# EAGLE design Interface (EAGLE 7.5.0)
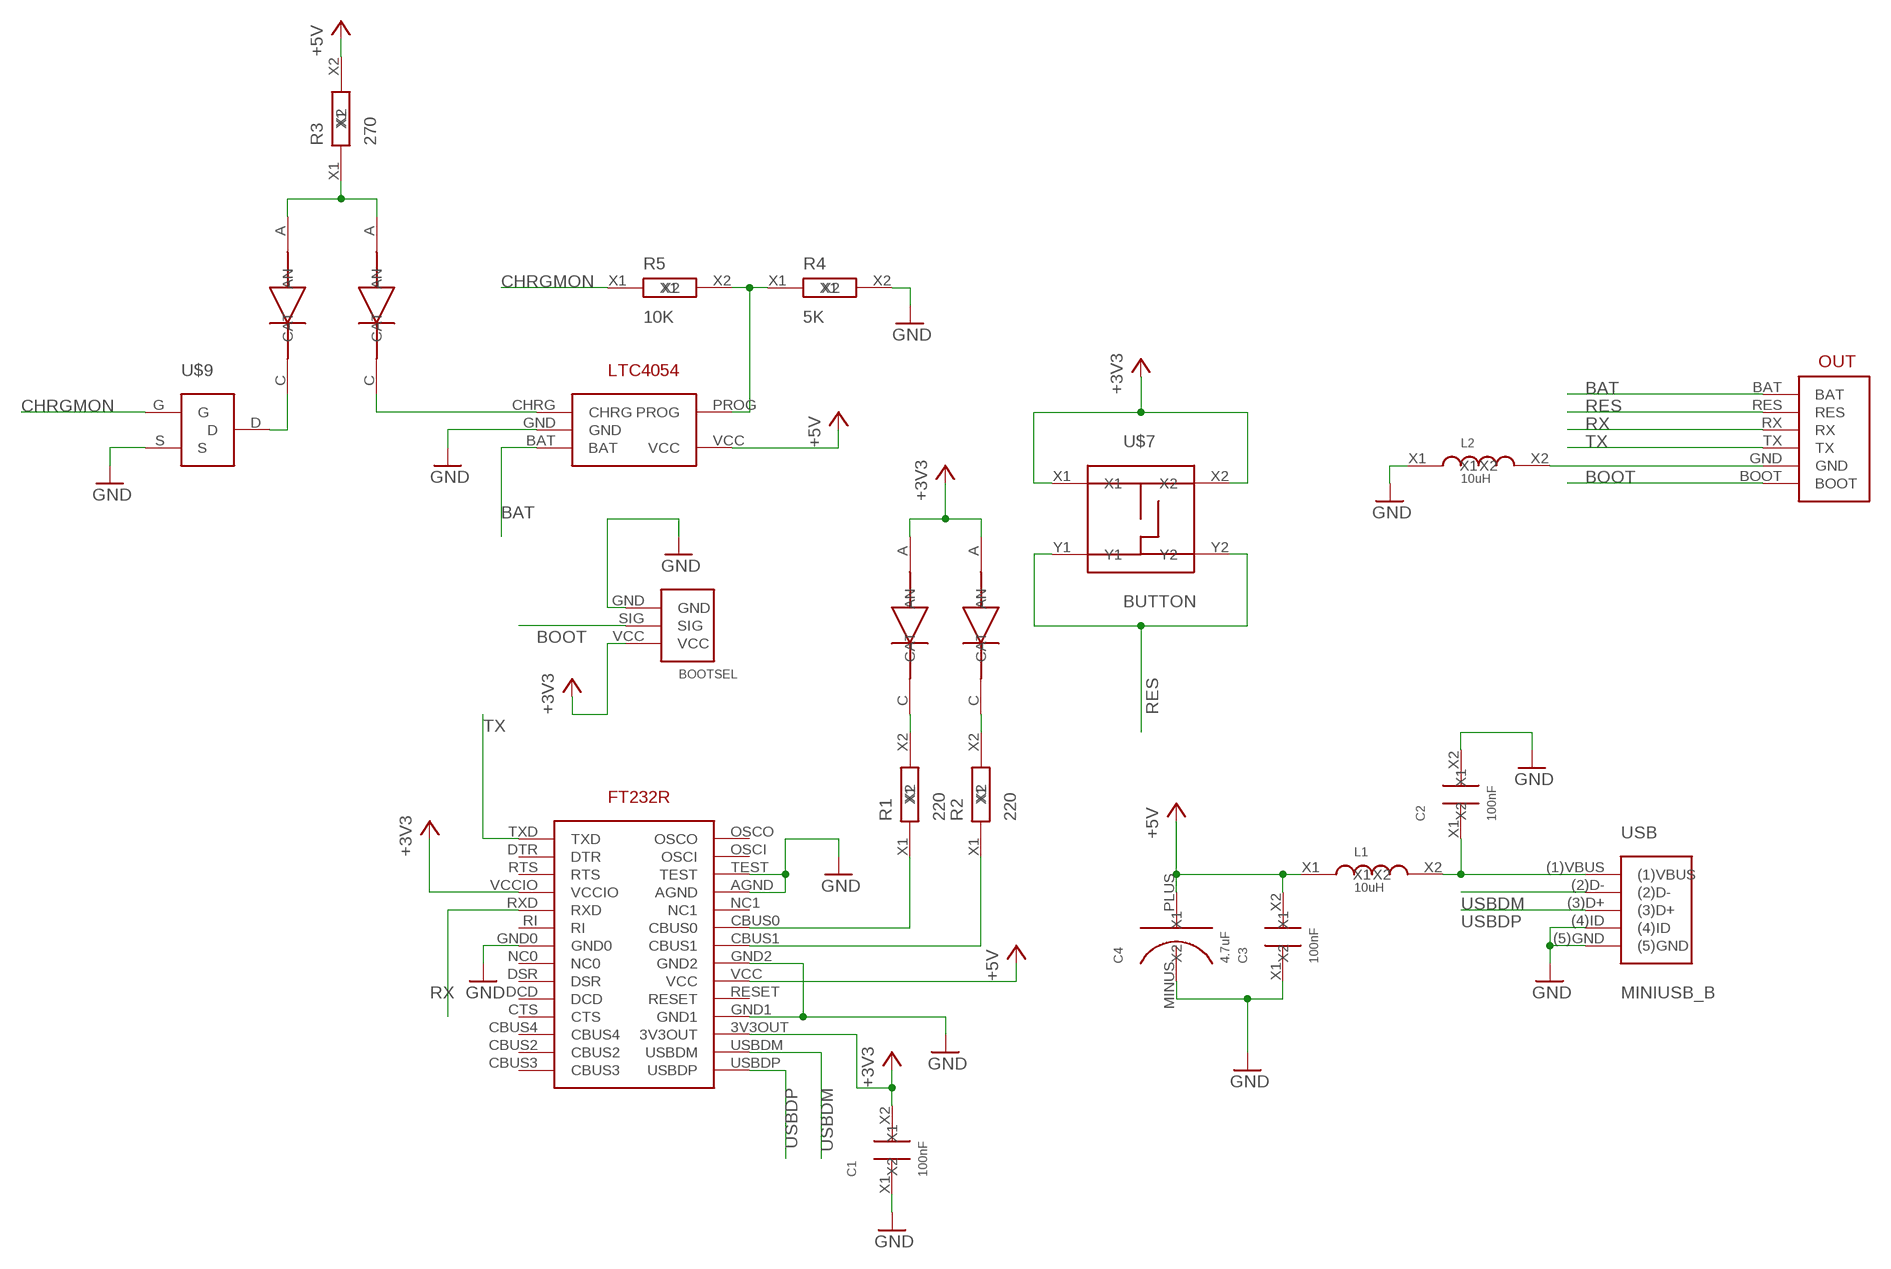
[diagram p0: schematic, sheet 1]

## Parts
BOOTSEL  BOOT3PIN  [BOOT3PIN]
C1  100nF  C_SMD_2.1X1.25  [SMD_2.1X1.25]
C2  100nF  C_SMD_2.1X1.25  [SMD_2.1X1.25]
C3  100nF  C_SMD_2.1X1.25  [SMD_2.1X1.25]
C4  4.7uF  C_SMD_TA_A  [C_SMD_TA_A]
L1  10uH  L_SMD_2.1X1.25  [SMD_2.1X1.25]
L2  10uH  L_SMD_2.1X1.25  [SMD_2.1X1.25]
R1  220  R_SMD_2.1X1.25  [SMD_2.1X1.25]
R2  220  R_SMD_2.1X1.25  [SMD_2.1X1.25]
R3  270  R_SMD_2.1X1.25  [SMD_2.1X1.25]
R4  5K  R_SMD_2.1X1.25  [SMD_2.1X1.25]
R5  10K  R_SMD_2.1X1.25  [SMD_2.1X1.25]
U$1  FT232R  [FT232]
U$2  LTC4054  [LTC4054]
U$3  LED0805  [LED0805]
U$4  LED0805  [LED0805]
U$5  LED0805  [LED0805]
U$6  LED0805  [LED0805]
U$7  BUTTON  [BUTTON]
U$8  PLUG6PIN  [PLUG6PIN]
U$9  IRFML8244TRPBF  [IRFML8244TRPBF]
USB  MINIUSB_B  [MINIUSB_B]

## Nets
+3V3: BOOTSEL.VCC C1.X2 U$1.3V3OUT U$1.VCCIO U$4.A(AN) U$6.A(AN) U$7.X1 U$7.X2
+5V: C3.X2 C4.PLUS(X2) L1.X1 R3.X2 U$1.VCC U$2.VCC
BAT: U$2.BAT U$8.BAT
BOOT: BOOTSEL.SIG U$8.BOOT
CHRGMON: R5.X1 U$9.G
GND: BOOTSEL.GND C1.X1 C2.X2 C3.X1 C4.MINUS(X1) L2.X1 R4.X2 U$1.AGND U$1.GND0 U$1.GND1 U$1.GND2 U$1.TEST U$2.GND U$9.S USB.(4)ID USB.(5)GND
N$1: C2.X1 L1.X2 USB.(1)VBUS
N$2: R3.X1 U$3.A(AN) U$5.A(AN)
N$3: R1.X2 U$4.C(CAT)
N$4: R2.X2 U$6.C(CAT)
N$5: R1.X1 U$1.CBUS0
N$6: R2.X1 U$1.CBUS1
N$7: U$2.CHRG U$3.C(CAT)
N$8: U$5.C(CAT) U$9.D
N$9: L2.X2 U$8.GND
N$10: R4.X1 R5.X2 U$2.PROG
RES: U$7.Y1 U$7.Y2 U$8.RES
RX: U$1.RXD U$8.RX
TX: U$1.TXD U$8.TX
USBDM: U$1.USBDM USB.(2)D-
USBDP: U$1.USBDP USB.(3)D+
Unconnected: U$1.CBUS2 U$1.CBUS3 U$1.CBUS4 U$1.CTS U$1.DCD U$1.DSR U$1.DTR U$1.NC0 U$1.NC1 U$1.OSCI U$1.OSCO U$1.RESET U$1.RI U$1.RTS

## Library data of the parts
BOOTSEL = MyCMOSsensor:BOOT3PIN
C1-C3 = MyPowerComponents:C_SMD_2.1X1.25
C4 = MyAmSys:C_SMD_TA_A
L1 L2 = MyPowerComponents:L_SMD_2.1X1.25
R1-R5 = MyPowerComponents:R_SMD_2.1X1.25
U$1 = My_FTDI:FT232R
U$2 = My_FTDI:LTC4054
U$3-U$6 = My_FTDI:LED0805
U$7 = My_STM32:BUTTON
U$8 = My_FTDI:PLUG6PIN
U$9 = My_STM32:IRFML8244TRPBF
USB = MyCMOSsensor:MINIUSB_B

## Board
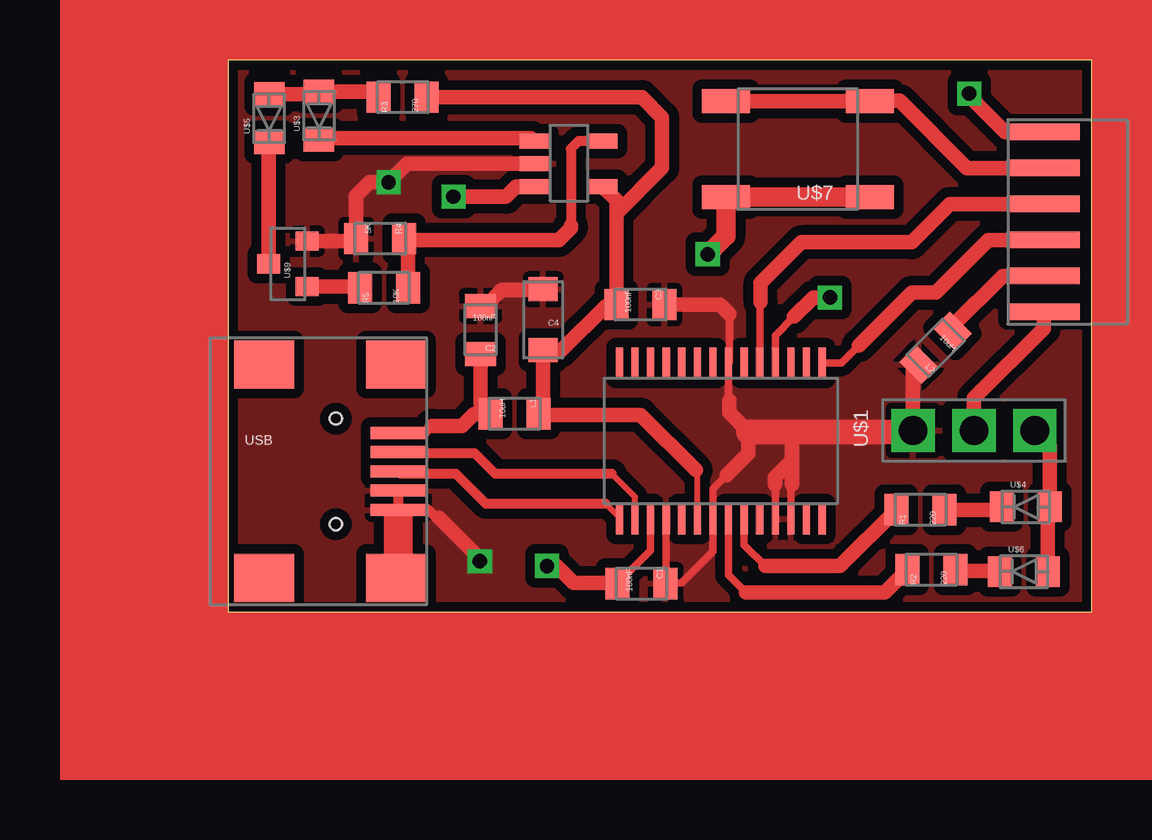
[diagram p1: board, top side]
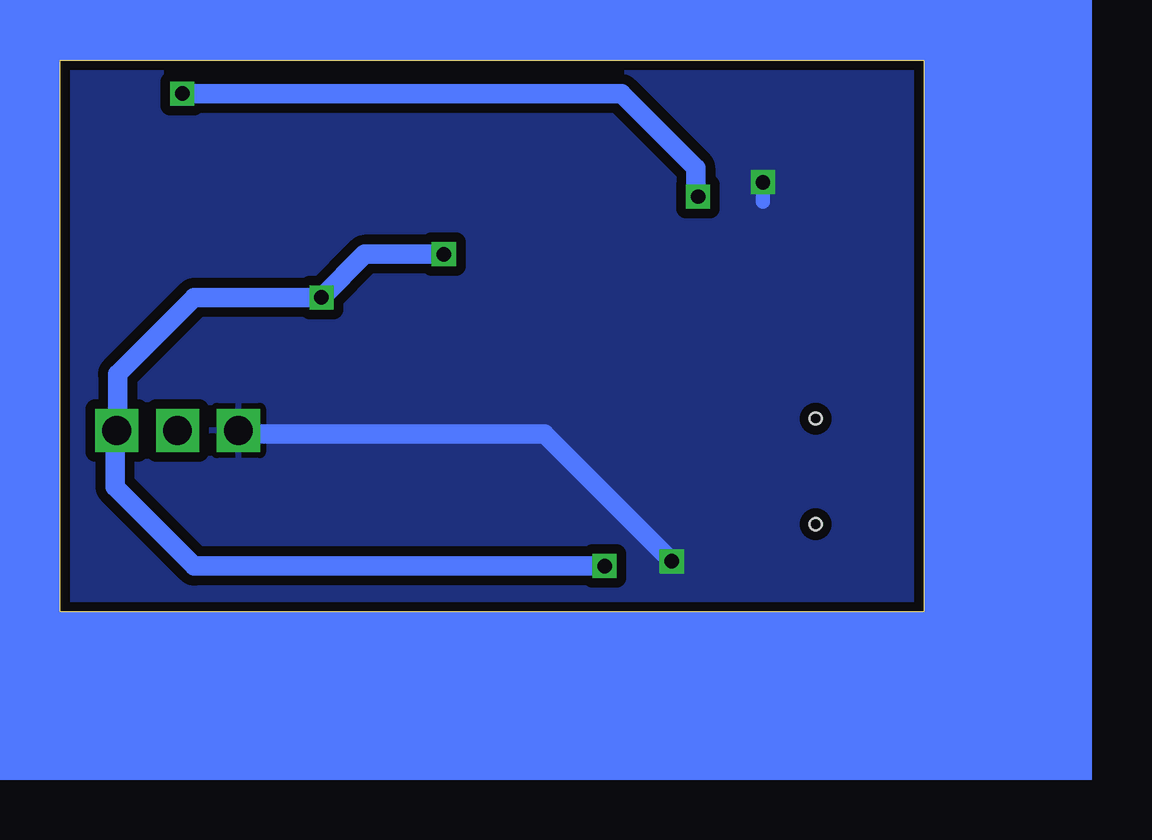
[diagram p2: board, bottom side, seen from below]

Size 36 x 23 mm. Coordinates in mm from the lower left corner, seen from the top.
Outline: 0,0 36,0 36,23 0,23 0,0
Copper layers (1*16): Top 0.018mm / dielectric 1.5mm / Bottom 0.018mm
Design rules "default *": minimum track width 10mil, minimum drill 24mil, track to track 8mil, track to pad 8mil, pad to pad 8mil, via to via 8mil, smd to smd 8mil, copper to edge 8mil, drill to drill 8mil, minimum pad ring 10mil, minimum via ring 8mil, stop-mask expansion 4mil, vias tented up to drill 0mil, thermal gap 10mil

### Footprints (pad centres in the part's own frame; a part is rotated, then mirrored left to right if it is on the bottom)
BOOT3PIN = drill 1.2 square: GND 0,2.54; SIG 0,0; VCC 0,-2.54
SMD_2.1X1.25 = smd 1.3 x 1: X1 0,1; X2 0,-1
C_SMD_TA_A = smd 1.2 x 1: MINUS 0,-1.27; PLUS 0,1.27
FT232 = smd 1.3 x 0.3: 3V3OUT 3.25,-2.6; AGND 3.25,2.6; CBUS0 3.25,1.3; CBUS1 3.25,0.65; CBUS2 -3.25,-3.25; CBUS3 -3.25,-3.9; CBUS4 -3.25,-2.6; CTS -3.25,-1.95; DCD -3.25,-1.3; DSR -3.25,-0.65; DTR -3.25,3.9; GND0 -3.25,0.65; GND1 3.25,-1.95; GND2 3.25,0; NC0 -3.25,0; NC1 3.25,1.95; OSCI 3.25,3.9; OSCO 3.25,4.55; RESET 3.25,-1.3; RI -3.25,1.3; RTS -3.25,3.25; RXD -3.25,1.95; TEST 3.25,3.25; TXD -3.25,4.55; USBDM 3.25,-3.25; USBDP 3.25,-3.9; VCC 3.25,-0.65; VCCIO -3.25,2.6
LTC4054 = smd 1.22 x 0.62: BAT -0.95,-0.95; CHRG -0.95,0.95; GND -0.95,0; PROG 1.9,0.95; VCC 1.9,-0.95
LED0805 = smd 1.27 x 1: A 0,1; C 0,-1
BUTTON = smd 2 x 1: X1 -3,2; X2 3,2; Y1 -3,-2; Y2 3,-2
PLUG6PIN = smd 3 x 0.7: BAT 0,4.5; BOOT 0,-3; GND 0,-1.5; RES 0,3; RX 0,1.5; TX 0,0
IRFML8244TRPBF = smd 0.802 x 0.972: D 0,0.8; G -0.95,-0.8; S 0.95,-0.8
MINIUSB_B = smd 2.3 x 0.5: (1)VBUS 0,1.6; (2)D- 0,0.8; (3)D+ 0,0; (4)ID 0,-0.8; (5)GND 0,-1.6 | smd 2.5 x 2: PG1 -0.1,-4.45; PG2 -5.6,-4.45; PG3 -5.6,4.45; PG4 -0.1,4.45 | hole 0.5: -2.6,2.2; -2.6,-2.2

### Placement (x,y rotation side)
BOOTSEL  31.1,7.55 90 top
C1  17.24,1.17 270 top
C2  10.53,11.75 180 top
C3  17.19,12.8 270 top
C4  13.14,12.17 180 top
L1  11.95,8.25 270 top
L2  29.5,11 135 top
R1  28.87,4.25 90 top
R2  29.33,1.75 90 top
R3  7.29,21.45 90 top
R4  6.35,15.55 270 top
R5  6.5,13.5 90 top
U$1  20.22,7.12 270 top
U$2  13.72,18.67 0 top
U$3  3.8,20.67 0 top
U$4  33.26,4.37 270 top
U$5  1.72,20.57 0 top
U$6  33.18,1.67 270 top
U$7  23.75,19.28 180 top
U$8  34,15.5 0 top
U$9  2.5,14.5 90 top
USB  7.1,5.85 0 top

### Tracks (layer width: path | path; a pad name or v marks a point on that pad's centre or on a via)
+3V3  (via drill 0.6)
  Top 0.305: U$1.VCCIO 22.82,11.52 23.6,12.3 | U$1.3V3OUT 17.62,2.55 C1.X2
  Top 0.61: U$6.A 34.18,4.29 U$4.A 34.26,6.93 BOOTSEL.VCC | 23.6,12.3 24.4,13.1 v25.1,13.1 | v13.3,1.9 13.7,1.9 14.4,1.2 16.21,1.2 C1.X2
  Top 0.813: v20,14.9 20.75,15.65 U$7.X2 U$7.X1
  Bottom 0.813: v13.3,1.9 30.4,1.9 33.7,5.2 33.7,7.49 BOOTSEL.VCC | BOOTSEL.VCC 33.6,7.59 33.6,9.9 30.4,13.1 v25.1,13.1 23.3,14.9 v20,14.9 | 33.99,7.2 BOOTSEL.VCC
+5V
  Top 0.254: U$1.VCC 19.57,5.83 19.5,5.9
  Top 0.61: 19.5,5.9 17.2,8.2 13,8.2 L1.X1 13.14,8.44 C4.PLUS 13.9,10.9 15.75,12.75 16.14,12.75 C3.X2 16.19,16.6 | 16.19,16.6 16.19,17.15 U$2.VCC | R3.X2 17.25,21.45 18.1,20.6 18.1,18.51 16.19,16.6
BAT  (via drill 0.6)
  Top 0.61: v30.9,21.6 30.9,21.5 32.4,20 U$8.BAT | U$2.BAT 12.02,17.72 11.6,17.3 v9.4,17.3
  Bottom 0.813: v30.9,21.6 12.6,21.6 9.5,18.5 9.5,17.4 v9.4,17.3
BOOT
  Top 0.61: U$8.BOOT 34,11.8 31.1,8.9 BOOTSEL.SIG
CHRGMON
  Top 0.61: U$9.G 5.45,13.55 R5.X1
GND  (via drill 0.6)
  Top 0.305: U$1.GND1 18.27,1.2 | 18.27,1.2 18.9,1.2 20.22,2.52 U$1.GND2 20.22,5.12 20.8,5.7 | 18.27,1.2 C1.X1 | 20.9,8.8 20.87,8.83 U$1.GND0 20.9,10.4 20.9,12.4 | U$1.TEST 23.47,5.27 23.5,5.3 | U$1.AGND 22.82,5.28 22.8,5.3
  Top 0.406: USB.(5)GND USB.(4)ID 7.1,4.4 7.2,4.3 8.3,4.3 8.7,3.9 8.8,3.9
  Top 0.61: 20.9,8.8 20.9,8.3 21.7,7.5 21.7,6.6 20.8,5.7 | 23.5,5.3 23.5,6.3 | 23.5,6.3 23.5,7.5 | 22.8,5.3 22.8,5.6 23.5,6.3 | BOOTSEL.GND 28.56,10.06 L2.X1 | C2.X2 10.75,12.75 11.4,13.4 13.1,13.4 C4.MINUS | C3.X1 20.5,12.8 20.9,12.4 | v10.5,2.1 10.5,2.2 8.8,3.9 | U$9.S 5.25,15.45 R4.X2 5.35,17.35 5.9,17.9 v6.7,17.9 7.47,18.67 U$2.GND
  Top 1.016: 21.7,7.5 23.5,7.5 28.51,7.5 BOOTSEL.GND
  Bottom 0.61: v6.7,17.9 6.7,17.1
  Bottom 0.813: v10.5,2.1 15.8,7.4 28.41,7.4 BOOTSEL.GND
  pour Bottom (isolate 0.406): 0,0 0,23 36,23 36,0
  pour Top (isolate 0.406): 0,0 36,0 36,23 0,23
N$1
  Top 0.406: USB.(1)VBUS 8.2,7.45 8.5,7.75
  Top 0.61: 8.5,7.75 9.75,7.75 10.25,8.25 L1.X2 10.53,8.67 C2.X1
N$2
  Top 0.61: U$5.A 3.7,21.57 U$3.A 6.07,21.67 R3.X1
N$3
  Top 0.61: R1.X2 32.14,4.25 U$4.C
N$4
  Top 0.61: R2.X2 30.35,1.75 30.4,1.7 32.15,1.7 U$6.C
N$5
  Top 0.305: U$1.CBUS0 21.52,2.78 22.4,1.9
  Top 0.61: 22.4,1.9 25.52,1.9 R1.X1
N$6
  Top 0.305: U$1.CBUS1 20.87,1.53 21.6,0.8
  Top 0.61: 21.6,0.8 27.38,0.8 R2.X1
N$7
  Top 0.61: U$3.C 3.88,19.75 12.64,19.75 U$2.CHRG
N$8
  Top 0.61: U$9.D 1.7,19.55 U$5.C
N$9
  Top 0.61: L2.X2 30.21,11.91 32.3,14 U$8.GND
N$10
  Top 0.406: U$2.PROG 14.62,19.62 14.3,19.3 14.3,16.1
  Top 0.61: R5.X2 7.5,15.4 R4.X1 7.4,15.5 13.8,15.5 14.3,16 14.3,16.1
RES
  Top 0.61: U$7.Y2 U$7.Y1 27.27,21.3 28,21.3 30.8,18.5 U$8.RES
RX
  Top 0.305: U$1.RXD 22.17,12.87 22.2,12.9
  Top 0.61: U$8.RX 30.1,17 28.5,15.4 23.9,15.4 22.2,13.7 22.2,12.9
TX
  Top 0.305: U$1.TXD 25.57,10.37 26.3,11.1
  Top 0.61: 26.3,11.1 28.5,13.3 29.5,13.3 31.7,15.5 U$8.TX
USBDM
  Top 0.254: U$1.USBDM 16.97,4.78 16,5.75
  Top 0.406: 16,5.75 11.15,5.75 10.3,6.6 7.15,6.6 USB.(2)D-
USBDP
  Top 0.254: U$1.USBDP 16.32,3.93 15.75,4.5
  Top 0.406: 15.75,4.5 10.75,4.5 9.5,5.75 7.2,5.75 USB.(3)D+
(copper drawn outside any net)
  shapes: Bottom area x4, Top area x5